# Altium schematic sheet SERIAL_FMU_REV_1A.SchDoc: Pixhawk_mini_8L.sch
size A4; Date: 18/08/2014 1:53:13 PM; DrawnBy: Philip Rowse; SheetNumber: 3; SheetTotal: 10
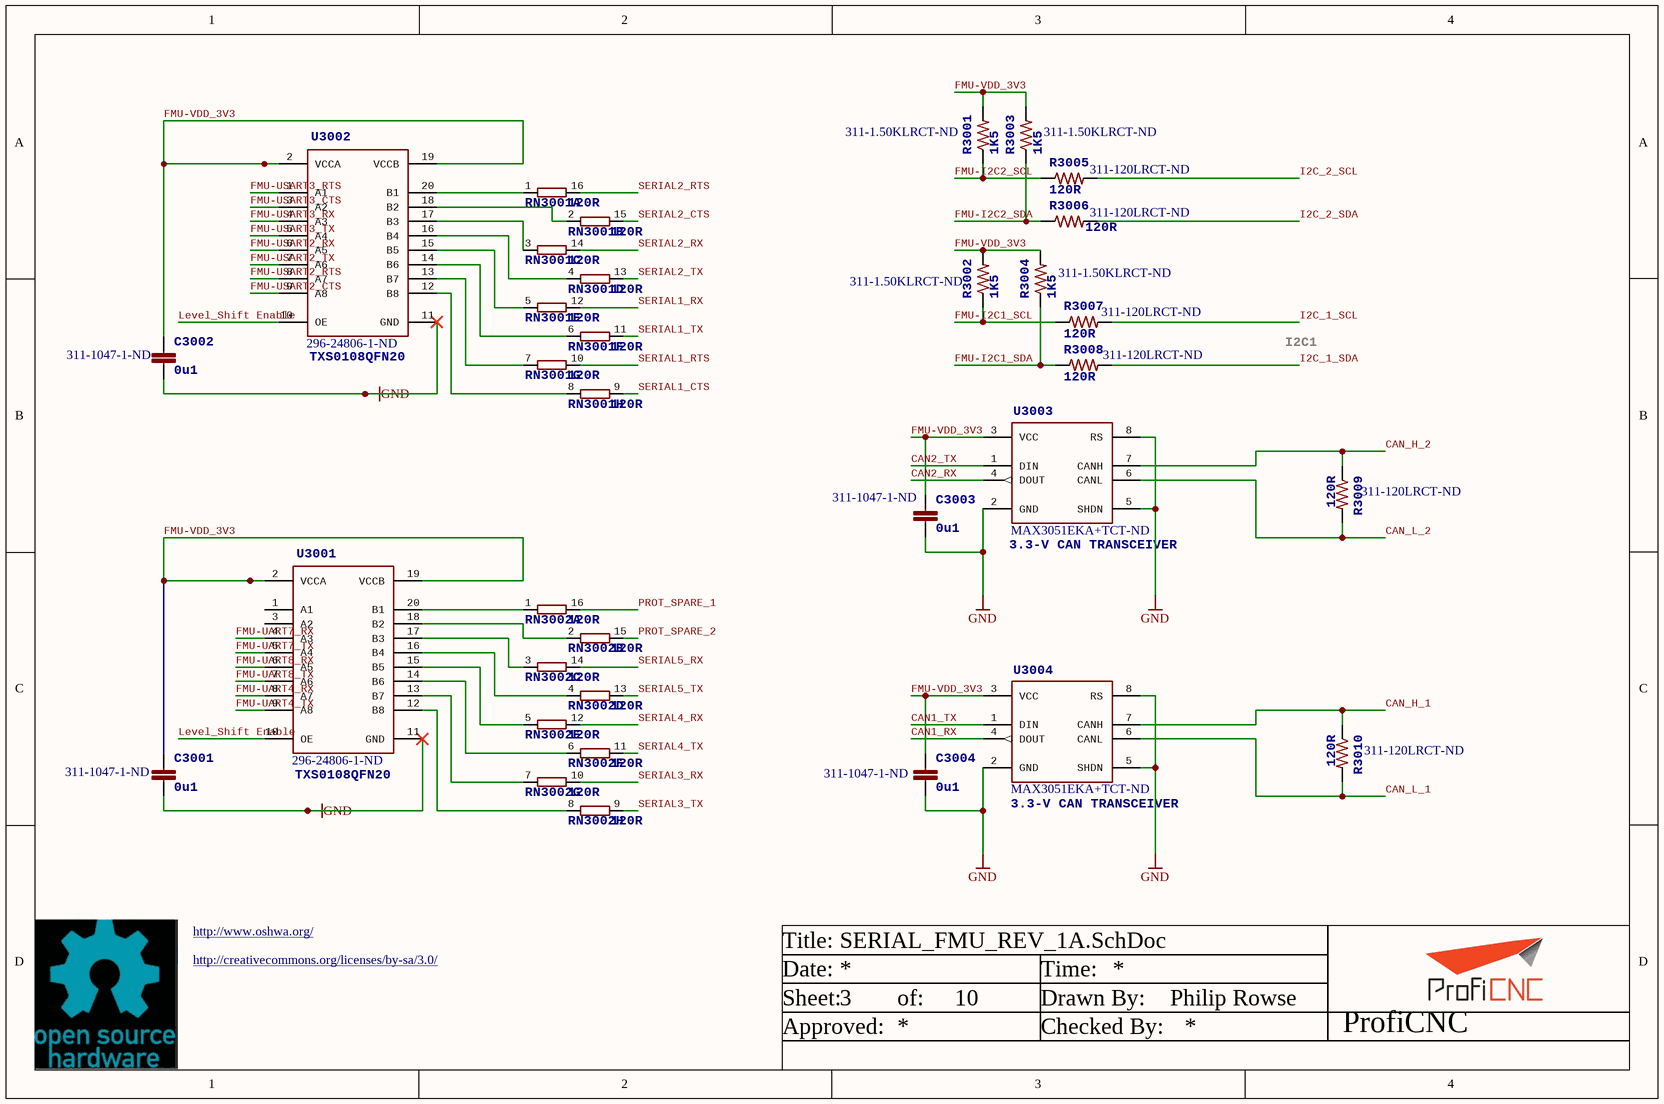
[diagram p0: SERIAL_FMU_REV_1A.SchDoc]

## Parts
C3001  0u1  Supplier Part Number 1: 311-1047-1-ND  [0402-CAP]
C3002  0u1  Supplier Part Number 1: 311-1047-1-ND  [0402-CAP]
C3003  0u1  Supplier Part Number 1: 311-1047-1-ND  [0402-CAP]
C3004  0u1  Supplier Part Number 1: 311-1047-1-ND  [0402-CAP]
R3001  1K5  Supplier Part Number 1: 311-1.50KLRCT-ND  [0402-RES]
R3002  1K5  Supplier Part Number 1: 311-1.50KLRCT-ND  [0402-RES]
R3003  1K5  Supplier Part Number 1: 311-1.50KLRCT-ND  [0402-RES]
R3004  1K5  Supplier Part Number 1: 311-1.50KLRCT-ND  [0402-RES]
R3005  120R  Supplier Part Number 1: 311-120LRCT-ND  [0402-RES]
R3006  120R  Supplier Part Number 1: 311-120LRCT-ND  [0402-RES]
R3007  120R  Supplier Part Number 1: 311-120LRCT-ND  [0402-RES]
R3008  120R  Supplier Part Number 1: 311-120LRCT-ND  [0402-RES]
R3009  120R  Supplier Part Number 1: 311-120LRCT-ND  [0402-RES]
R3010  120R  Supplier Part Number 1: 311-120LRCT-ND  [0402-RES]
RN3001  120R  [EXB2HV]  (parts A,B,C,D,E,F,G,H of 8)
RN3002  120R  [EXB2HV]  (parts A,B,C,D,E,F,G,H of 8)
U3001  TXS0108QFN20  Supplier Part Number 1: 296-24806-1-ND  [QFN20-RGY]
U3002  TXS0108QFN20  Supplier Part Number 1: 296-24806-1-ND  [QFN20-RGY]
U3003  3.3-V CAN TRANSCEIVER  Supplier Part Number 1: MAX3051EKA+TCT-ND  [SOT23-8]
U3004  3.3-V CAN TRANSCEIVER  Supplier Part Number 1: MAX3051EKA+TCT-ND  [SOT23-8]

## Nets
GND: C3001.P$2 C3002.P$2 C3003.P$2 C3004.P$2 U3001.11(GND) U3002.11(GND) U3003.2(GND) U3003.5(SHDN) U3003.8(RS) U3004.2(GND) U3004.5(SHDN) U3004.8(RS)
CAN1_RX: U3004.4(DOUT)
CAN1_TX: U3004.1(DIN)
CAN2_RX: U3003.4(DOUT)
CAN2_TX: U3003.1(DIN)
CAN_H_1: R3010.P$1 U3004.7(CANH)
CAN_H_2: R3009.P$1 U3003.7(CANH)
CAN_L_1: R3010.P$2 U3004.6(CANL)
CAN_L_2: R3009.P$2 U3003.6(CANL)
FMU-I2C1_SCL: R3002.P$1 R3007.P$1
FMU-I2C1_SDA: R3004.P$1 R3008.P$1
FMU-I2C2_SCL: R3001.P$1 R3005.P$1
FMU-I2C2_SDA: R3003.P$1 R3006.P$1
FMU-UART4_RX: U3001.8(A7)
FMU-UART4_TX: U3001.9(A8)
FMU-UART7_RX: U3001.4(A3)
FMU-UART7_TX: U3001.5(A4)
FMU-UART8_RX: U3001.6(A5)
FMU-UART8_TX: U3001.7(A6)
FMU-USART2_CTS: U3002.9(A8)
FMU-USART2_RTS: U3002.8(A7)
FMU-USART2_RX: U3002.6(A5)
FMU-USART2_TX: U3002.7(A6)
FMU-USART3_CTS: U3002.3(A2)
FMU-USART3_RTS: U3002.1(A1)
FMU-USART3_RX: U3002.4(A3)
FMU-USART3_TX: U3002.5(A4)
FMU-VDD_3V3: C3001.P$1 C3002.P$1 C3003.P$1 C3004.P$1 R3001.P$2 R3002.P$2 R3003.P$2 R3004.P$2 U3001.2(VCCA) U3001.19(VCCB) U3002.2(VCCA) U3002.19(VCCB) U3003.3(VCC) U3004.3(VCC)
I2C_1_SCL: R3007.P$2
I2C_1_SDA: R3008.P$2
I2C_2_SCL: R3005.P$2
I2C_2_SDA: R3006.P$2
Level_Shift Enable: U3001.10(OE) U3002.10(OE)
PROT_SPARE_1: RN3002.16
PROT_SPARE_2: RN3002.15
SERIAL1_CTS: RN3001.9
SERIAL1_RTS: RN3001.10
SERIAL1_RX: RN3001.12
SERIAL1_TX: RN3001.11
SERIAL2_CTS: RN3001.15
SERIAL2_RTS: RN3001.16
SERIAL2_RX: RN3001.14
SERIAL2_TX: RN3001.13
SERIAL3_RX: RN3002.10
SERIAL3_TX: RN3002.9
SERIAL4_RX: RN3002.12
SERIAL4_TX: RN3002.11
SERIAL5_RX: RN3002.14
SERIAL5_TX: RN3002.13
NetRN3001_1: RN3001.1 U3002.20(B1)
NetRN3001_2: RN3001.2 U3002.18(B2)
NetRN3001_3: RN3001.3 U3002.17(B3)
NetRN3001_4: RN3001.4 U3002.16(B4)
NetRN3001_5: RN3001.5 U3002.15(B5)
NetRN3001_6: RN3001.6 U3002.14(B6)
NetRN3001_7: RN3001.7 U3002.13(B7)
NetRN3001_8: RN3001.8 U3002.12(B8)
NetRN3002_1: RN3002.1 U3001.20(B1)
NetRN3002_2: RN3002.2 U3001.18(B2)
NetRN3002_3: RN3002.3 U3001.17(B3)
NetRN3002_4: RN3002.4 U3001.16(B4)
NetRN3002_5: RN3002.5 U3001.15(B5)
NetRN3002_6: RN3002.6 U3001.14(B6)
NetRN3002_7: RN3002.7 U3001.13(B7)
NetRN3002_8: RN3002.8 U3001.12(B8)

Not connected (* = marked no-connect by the designer): U3001 1(A1) 3(A2)

## Notes on the sheet
- I2C1
- http://www.oshwa.org/
- http://creativecommons.org/licenses/by-sa/3.0/
- Title:
- Date:
- Time:
- Sheet:
- Approved:
- of:
- Drawn By:
- Checked By:
- ProfiCNC

## Library data of the parts
C3001-C3004 = CAP0402: CAP CER 0.1UF 16V Y5V 0402; PARTNO: CC0402ZRY5V7BB104; 3DR_PARTNO: ECM0700; Supplier 1: Digi-Key; Value: 0u1
R3001-R3004 = RESISTOR0402-RES: RES 1.5K OHM 1/16W 1% 0402 SMD; PARTNO: RC0402FR-071K5L; 3DR_PARTNO: ECM0803; Supplier 1: Digi-Key; Value: 1K5
R3005-R3010 = RESISTOR0402-RES: RES 120 OHM 1/16W 1% 0402 SMD; PARTNO: RC0402FR-07120RL; 3DR_PARTNO: ECM0820; Supplier 1: Digi-Key; Value: 120R
RN3001 RN3002 = 8R-NEXB2HV-120R: RES ARRAY 120 OHM 8 RES 1506; PARTNO: EXB-2HV121JV; 3DR_PARTNO: EMC; OC_FARNELL: unknown; OC_NEWARK: unknown; Supplier 1: Digi-Key; Supplier Part Number 1: Y1121CT-ND; Value: 120R
U3001 U3002 = TXS0108QFN20: IC XLATR VOLT-LVL 8B BDIR 20QFN; 3DR_PARTNO: ECM0845; PARTNO: TXS0108ERGYR; Supplier 1: Digi-Key
U3003 U3004 = MAX3051MAX3051EKA: IC TXRX CAN 1MBPS SOT23-8; 3DR_PARTNO: ECM0831; PARTNO: MAX3051EKA+T; Supplier 1: Digi-Key; Value: CAN